# Altium schematic sheet micro.SchDoc: Micro controller
size A3; Author: Babaabasi; Engineer: Babaabasi; DocumentNumber: 1; Revision: 0.1
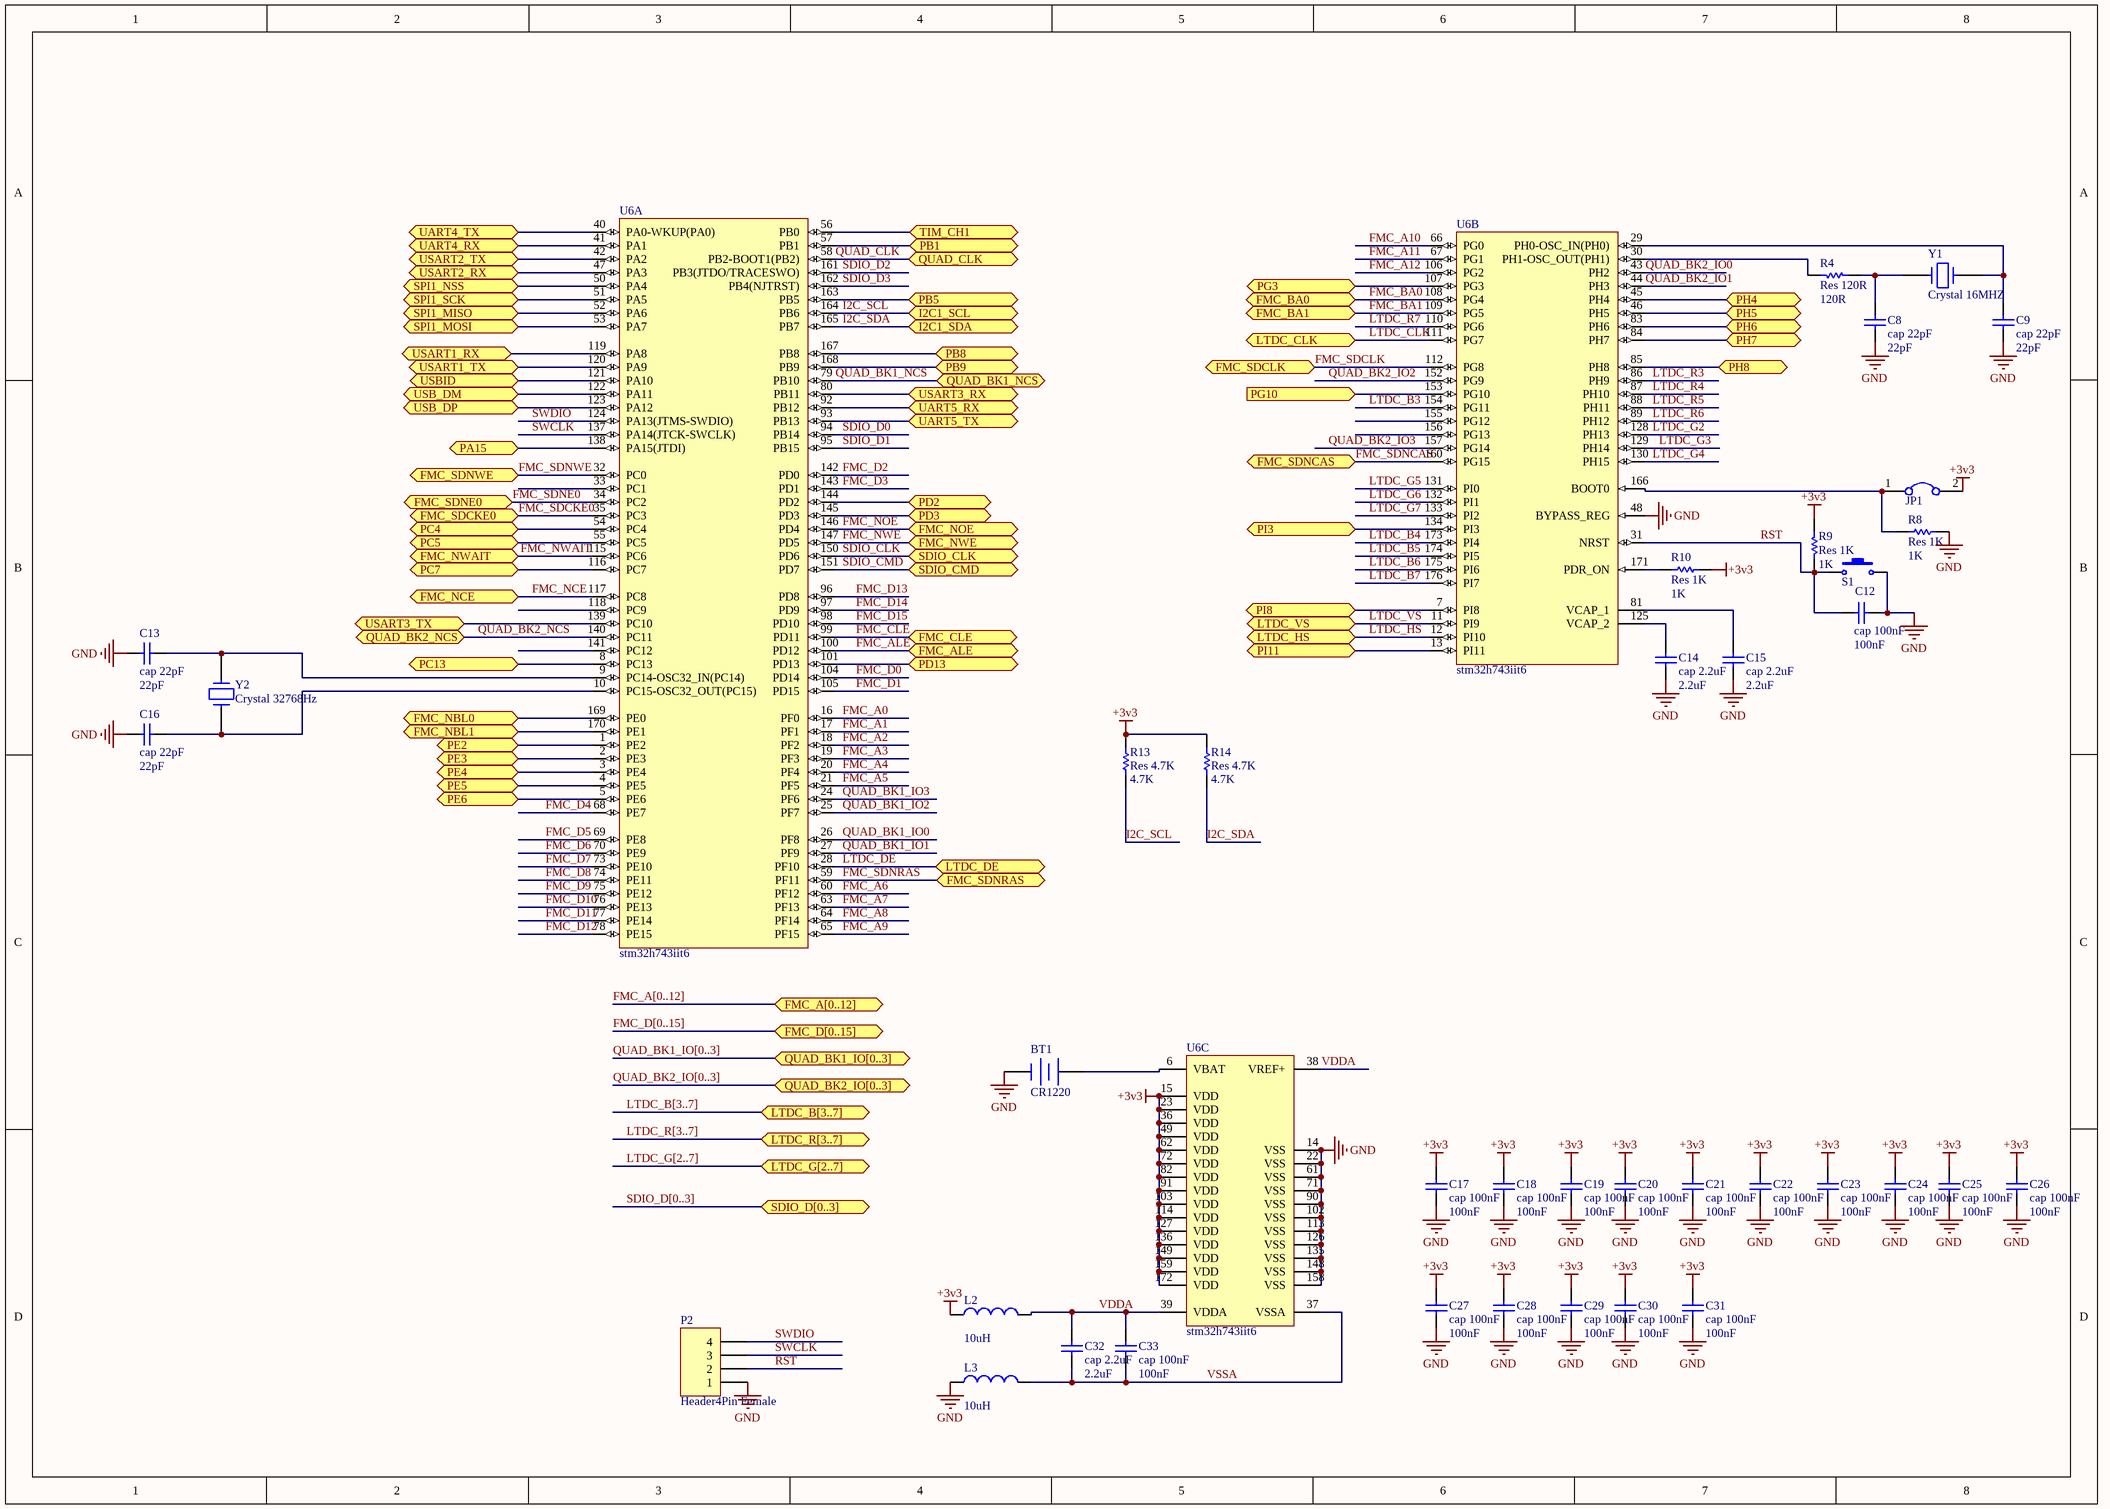
[diagram p0: micro.SchDoc]

## Parts
BT1  CR1220  [BTH1220]
C8  cap 22pF  value 22pF  [Cap 805]
C9  cap 22pF  value 22pF  [Cap 805]
C12  cap 100nF  value 100nF  [Cap 805]
C13  cap 22pF  value 22pF  [Cap 805]
C14  cap 2.2uF  value 2.2uF  [Cap 805]
C15  cap 2.2uF  value 2.2uF  [Cap 805]
C16  cap 22pF  value 22pF  [Cap 805]
C17  cap 100nF  value 100nF  [Cap 805]
C18  cap 100nF  value 100nF  [Cap 805]
C19  cap 100nF  value 100nF  [Cap 805]
C20  cap 100nF  value 100nF  [Cap 805]
C21  cap 100nF  value 100nF  [Cap 805]
C22  cap 100nF  value 100nF  [Cap 805]
C23  cap 100nF  value 100nF  [Cap 805]
C24  cap 100nF  value 100nF  [Cap 805]
C25  cap 100nF  value 100nF  [Cap 805]
C26  cap 100nF  value 100nF  [Cap 805]
C27  cap 100nF  value 100nF  [Cap 805]
C28  cap 100nF  value 100nF  [Cap 805]
C29  cap 100nF  value 100nF  [Cap 805]
C30  cap 100nF  value 100nF  [Cap 805]
C31  cap 100nF  value 100nF  [Cap 805]
C32  cap 2.2uF  value 2.2uF  [Cap 805]
C33  cap 100nF  value 100nF  [Cap 805]
JP1  Jumper  [Jumper Small - 2.54 - GRAY]  (value not drawn)  (no BOM)
L2  value 10uH  [IND1206]  (hidden comment: inductor 10uH)
L3  value 10uH  [IND1206]  (hidden comment: inductor 10uH)
P2  Header4Pin Female  [HDR1X4]
R4  Res 120R  value 120R  [RES 0805 (2012X06L)]
R8  Res 1K  value 1K  [RES 0805 (2012X06L)]
R9  Res 1K  value 1K  [RES 0805 (2012X06L)]
R10  Res 1K  value 1K  [RES 0805 (2012X06L)]
R13  Res 4.7K  value 4.7K  [RES 0805 (2012X06L)]
R14  Res 4.7K  value 4.7K  [RES 0805 (2012X06L)]
S1  Switch PB  [Switch - Push to On]  (value not drawn)
U6  stm32h743iit6  [STM-LQFP176_M]  (parts A,B,C of 3)
Y1  Crystal 16MHZ  [CRYSTAL Small]
Y2  Crystal 32768Hz  [XTAL RTC]

## Ports
FMC_A[0..12] (bidir), FMC_ALE (bidir), FMC_BA0 (bidir), FMC_BA1 (bidir), FMC_CLE (bidir), FMC_D[0..15] (bidir), FMC_NBL0 (bidir), FMC_NBL1 (bidir), FMC_NCE (bidir), FMC_NOE (bidir), FMC_NWAIT (bidir), FMC_NWE (bidir), FMC_SDCKE0 (bidir), FMC_SDCLK (bidir), FMC_SDNCAS (bidir), FMC_SDNE0 (bidir), FMC_SDNRAS (bidir), FMC_SDNWE (bidir), I2C1_SCL (bidir), I2C1_SDA (bidir), LTDC_B[3..7] (bidir), LTDC_CLK (bidir), LTDC_DE (bidir), LTDC_G[2..7] (bidir), LTDC_HS (bidir), LTDC_R[3..7] (bidir), LTDC_VS (bidir), PA15 (bidir), PB1 (bidir), PB5 (bidir), PB8 (bidir), PB9 (bidir), PC4 (bidir), PC5 (bidir), PC7 (bidir), PC13 (bidir), PD2 (bidir), PD3 (bidir), PD13 (bidir), PE2 (bidir), PE3 (bidir), PE4 (bidir), PE5 (bidir), PE6 (bidir), PG3 (bidir), PG10 (in), PH4 (bidir), PH5 (bidir), PH6 (bidir), PH7 (bidir), PH8 (bidir), PI3 (bidir), PI8 (bidir), PI11 (bidir), QUAD_BK1_IO[0..3] (bidir), QUAD_BK1_NCS (bidir), QUAD_BK2_IO[0..3] (bidir), QUAD_BK2_NCS (bidir), QUAD_CLK (bidir), SDIO_CLK (bidir), SDIO_CMD (bidir), SDIO_D[0..3] (bidir), SPI1_MISO (bidir), SPI1_MOSI (bidir), SPI1_NSS (bidir), SPI1_SCK (bidir), TIM_CH1 (bidir), UART4_RX (bidir), UART4_TX (bidir), UART5_RX (bidir), UART5_TX (bidir), USART1_RX (bidir), USART1_TX (bidir), USART2_RX (bidir), USART2_TX (bidir), USART3_RX (bidir), USART3_TX (bidir), USB_DM (bidir), USB_DP (bidir), USBID (bidir)

## Nets
+3v3: C17.2 C18.2 C19.2 C20.2 C21.2 C22.2 C23.2 C24.2 C25.2 C26.2 C27.2 C28.2 C29.2 C30.2 C31.2 JP1.2 L2.1 R9.1 R10.2 R13.1 R14.1 U6.15(VDD) U6.23(VDD) U6.36(VDD) U6.49(VDD) U6.62(VDD) U6.72(VDD) U6.82(VDD) U6.91(VDD) U6.103(VDD) U6.114(VDD) U6.127(VDD) U6.136(VDD) U6.149(VDD) U6.159(VDD) U6.172(VDD)
GND: BT1.2(-) C8.1 C9.2 C12.2 C13.1 C14.1 C15.1 C16.1 C17.1 C18.1 C19.1 C20.1 C21.1 C22.1 C23.1 C24.1 C25.1 C26.1 C27.1 C28.1 C29.1 C30.1 C31.1 L3.1 P2.1 R8.2 S1.1 U6.14(VSS) U6.22(VSS) U6.48(BYPASS_REG) U6.61(VSS) U6.71(VSS) U6.90(VSS) U6.102(VSS) U6.113(VSS) U6.126(VSS) U6.135(VSS) U6.148(VSS) U6.158(VSS)
FMC_A0: U6.16(PF0)
FMC_A1: U6.17(PF1)
FMC_A2: U6.18(PF2)
FMC_A3: U6.19(PF3)
FMC_A4: U6.20(PF4)
FMC_A5: U6.21(PF5)
FMC_A6: U6.60(PF12)
FMC_A7: U6.63(PF13)
FMC_A8: U6.64(PF14)
FMC_A9: U6.65(PF15)
FMC_A10: U6.66(PG0)
FMC_A11: U6.67(PG1)
FMC_A12: U6.106(PG2)
FMC_ALE: U6.100(PD12) ; port FMC_ALE
FMC_BA0: U6.108(PG4) ; port FMC_BA0
FMC_BA1: U6.109(PG5) ; port FMC_BA1
FMC_CLE: U6.99(PD11) ; port FMC_CLE
FMC_D0: U6.104(PD14)
FMC_D1: U6.105(PD15)
FMC_D2: U6.142(PD0)
FMC_D3: U6.143(PD1)
FMC_D4: U6.68(PE7)
FMC_D5: U6.69(PE8)
FMC_D6: U6.70(PE9)
FMC_D7: U6.73(PE10)
FMC_D8: U6.74(PE11)
FMC_D9: U6.75(PE12)
FMC_D10: U6.76(PE13)
FMC_D11: U6.77(PE14)
FMC_D12: U6.78(PE15)
FMC_D13: U6.96(PD8)
FMC_D14: U6.97(PD9)
FMC_D15: U6.98(PD10)
FMC_NBL0: U6.169(PE0) ; port FMC_NBL0
FMC_NBL1: U6.170(PE1) ; port FMC_NBL1
FMC_NCE: U6.117(PC8) ; port FMC_NCE
FMC_NOE: U6.146(PD4) ; port FMC_NOE
FMC_NWAIT: U6.115(PC6) ; port FMC_NWAIT
FMC_NWE: U6.147(PD5) ; port FMC_NWE
FMC_SDCKE0: U6.35(PC3) ; port FMC_SDCKE0
FMC_SDCLK: U6.112(PG8) ; port FMC_SDCLK
FMC_SDNCAS: U6.160(PG15) ; port FMC_SDNCAS
FMC_SDNE0: U6.34(PC2) ; port FMC_SDNE0
FMC_SDNRAS: U6.59(PF11) ; port FMC_SDNRAS
FMC_SDNWE: U6.32(PC0) ; port FMC_SDNWE
I2C_SCL: R13.2 U6.164(PB6) ; port I2C1_SCL
I2C_SDA: R14.2 U6.165(PB7) ; port I2C1_SDA
LTDC_B3: U6.154(PG11)
LTDC_B4: U6.173(PI4)
LTDC_B5: U6.174(PI5)
LTDC_B6: U6.175(PI6)
LTDC_B7: U6.176(PI7)
LTDC_CLK: U6.111(PG7) ; port LTDC_CLK
LTDC_DE: U6.28(PF10) ; port LTDC_DE
LTDC_G2: U6.128(PH13)
LTDC_G3: U6.129(PH14)
LTDC_G4: U6.130(PH15)
LTDC_G5: U6.131(PI0)
LTDC_G6: U6.132(PI1)
LTDC_G7: U6.133(PI2)
LTDC_HS: U6.12(PI10) ; port LTDC_HS
LTDC_R3: U6.86(PH9)
LTDC_R4: U6.87(PH10)
LTDC_R5: U6.88(PH11)
LTDC_R6: U6.89(PH12)
LTDC_R7: U6.110(PG6)
LTDC_VS: U6.11(PI9) ; port LTDC_VS
PA15: U6.138(PA15(JTDI)) ; port PA15
PB1: U6.57(PB1) ; port PB1
PB5: U6.163(PB5) ; port PB5
PB8: U6.167(PB8) ; port PB8
PB9: U6.168(PB9) ; port PB9
PC4: U6.54(PC4) ; port PC4
PC5: U6.55(PC5) ; port PC5
PC7: U6.116(PC7) ; port PC7
PC13: U6.8(PC13) ; port PC13
PD2: U6.144(PD2) ; port PD2
PD3: U6.145(PD3) ; port PD3
PD13: U6.101(PD13) ; port PD13
PE2: U6.1(PE2) ; port PE2
PE3: U6.2(PE3) ; port PE3
PE4: U6.3(PE4) ; port PE4
PE5: U6.4(PE5) ; port PE5
PE6: U6.5(PE6) ; port PE6
PG3: U6.107(PG3) ; port PG3
PG10: U6.153(PG10) ; port PG10
PH4: U6.45(PH4) ; port PH4
PH5: U6.46(PH5) ; port PH5
PH6: U6.83(PH6) ; port PH6
PH7: U6.84(PH7) ; port PH7
PH8: U6.85(PH8) ; port PH8
PI3: U6.134(PI3) ; port PI3
PI8: U6.7(PI8) ; port PI8
PI11: U6.13(PI11) ; port PI11
QUAD_BK1_IO0: U6.26(PF8)
QUAD_BK1_IO1: U6.27(PF9)
QUAD_BK1_IO2: U6.25(PF7)
QUAD_BK1_IO3: U6.24(PF6)
QUAD_BK1_NCS: U6.79(PB10) ; port QUAD_BK1_NCS
QUAD_BK2_IO0: U6.43(PH2)
QUAD_BK2_IO1: U6.44(PH3)
QUAD_BK2_IO2: U6.152(PG9)
QUAD_BK2_IO3: U6.157(PG14)
QUAD_BK2_NCS: U6.140(PC11) ; port QUAD_BK2_NCS
QUAD_CLK: U6.58(PB2-BOOT1(PB2)) ; port QUAD_CLK
RST: C12.1 P2.2 R9.2 S1.2 U6.31(NRST)
SDIO_CLK: U6.150(PD6) ; port SDIO_CLK
SDIO_CMD: U6.151(PD7) ; port SDIO_CMD
SDIO_D0: U6.94(PB14)
SDIO_D1: U6.95(PB15)
SDIO_D2: U6.161(PB3(JTDO/TRACESWO))
SDIO_D3: U6.162(PB4(NJTRST))
SPI1_MISO: U6.52(PA6) ; port SPI1_MISO
SPI1_MOSI: U6.53(PA7) ; port SPI1_MOSI
SPI1_NSS: U6.50(PA4) ; port SPI1_NSS
SPI1_SCK: U6.51(PA5) ; port SPI1_SCK
SWCLK: P2.3 U6.137(PA14(JTCK-SWCLK))
SWDIO: P2.4 U6.124(PA13(JTMS-SWDIO))
TIM_CH1: U6.56(PB0) ; port TIM_CH1
UART4_RX: U6.41(PA1) ; port UART4_RX
UART4_TX: U6.40(PA0-WKUP(PA0)) ; port UART4_TX
UART5_RX: U6.92(PB12) ; port UART5_RX
UART5_TX: U6.93(PB13) ; port UART5_TX
USART1_RX: U6.119(PA8) ; port USART1_RX
USART1_TX: U6.120(PA9) ; port USART1_TX
USART2_RX: U6.47(PA3) ; port USART2_RX
USART2_TX: U6.42(PA2) ; port USART2_TX
USART3_RX: U6.80(PB11) ; port USART3_RX
USART3_TX: U6.139(PC10) ; port USART3_TX
USB_DM: U6.122(PA11) ; port USB_DM
USB_DP: U6.123(PA12) ; port USB_DP
USBID: U6.121(PA10) ; port USBID
VDDA: C32.2 C33.2 L2.2 U6.38(VREF+) U6.39(VDDA)
VSSA: C32.1 C33.1 L3.2 U6.37(VSSA)
NetBT1_1: BT1.1(+) U6.6(VBAT)
NetC8_2: C8.2 R4.2 Y1.2
NetC9_1: C9.1 U6.29(PH0-OSC_IN(PH0)) Y1.1
NetC13_2: C13.2 U6.9(PC14-OSC32_IN(PC14)) Y2.1
NetC14_2: C14.2 U6.125(VCAP_2)
NetC15_2: C15.2 U6.81(VCAP_1)
NetC16_2: C16.2 U6.10(PC15-OSC32_OUT(PC15)) Y2.2
NetJP1_1: JP1.1 R8.1 U6.166(BOOT0)
NetR4_1: R4.1 U6.30(PH1-OSC_OUT(PH1))
NetR10_1: R10.1 U6.171(PDR_ON)

Not connected (* = marked no-connect by the designer): U6 33(PC1) 118(PC9) 141(PC12) 155(PG12) 156(PG13)

## Buses and harness runs
bus FMC_A[0..12] = port FMC_A[0..12]
bus FMC_D[0..15] = port FMC_D[0..15]
bus LTDC_B[3..7] = port LTDC_B[3..7]
bus LTDC_G[2..7] = port LTDC_G[2..7]
bus LTDC_R[3..7] = port LTDC_R[3..7]
bus QUAD_BK1_IO[0..3] = port QUAD_BK1_IO[0..3]
bus QUAD_BK2_IO[0..3] = port QUAD_BK2_IO[0..3]
bus SDIO_D[0..3] = port SDIO_D[0..3]

## Notes on the sheet
- Title
- Size:
- Date:
- A3
- Number:
- Time:
- Revision:
- Sheet
- of
- File:

## Library data of the parts
BT1 = Battery: CoinCell Battery; Published: 24-Mar-1999; LatestRevisionDate: 17-Jul-2002; LatestRevisionNote: Re-released for DXP Platform.; PackageReference: BAT-2; Publisher: Altium Limited; PackageDescription: Battery; 2 Leads
C8 C9 C12-C33 = Cap: Capacitor; Published: 8-Jun-2000; LatestRevisionDate: 17-Jul-2002; LatestRevisionNote: Re-released for DXP Platform.; PackageReference: RAD-0.3; Publisher: Altium Limited; PackageDescription: Radial Cap, Thru-Hole; 2 Leads; 0.3 in Pin Spacing
JP1 = Jumper: Boot select; Company: E.P.I.L; Defualt State: Close; Design Date: 2011/11/02
L2 L3 = Inductor: Code_IEC: 1005; Published: 8-Jun-2000; LatestRevisionDate: 29-May-2009; LatestRevisionNote: IPC-7351 Footprint Added.; PackageReference: 0402-A; Publisher: Altium Limited; PackageDescription: Chip Inductor; Code_JEITA: 0402
P2 = Header 4: Header, 4-Pin; LatestRevisionDate: 17-Jul-2002; LatestRevisionNote: Re-released for DXP Platform.; Publisher: Altium Limited
R4 R8-R10 R13 R14 = Res1: Resistor; Published: 8-Jun-2000; LatestRevisionDate: 17-Jul-2002; LatestRevisionNote: Re-released for DXP Platform.; PackageReference: AXIAL-0.3; Publisher: Altium Limited; PackageDescription: Axial Device, Thru-Hole; 2 Leads; 0.3 in Pin Spacing
S1 = Switch PB: Push Button Switch
U6 = STM32F429IGT6: ARM Cortex-M4 32-bit MCU+FPU, 225 DMIPS, 1024 kB Flash, 256 kB Internal RAM, 140 I/Os, 176-pin LQFP, -40 to 85 degC, Tray; Manufacturer: STMicroelectronics; D/A Converter: 2x12-bit; FLASH Size (Prog) (kB): 1024; I/Os (High Current): 140; Internal RAM Size (kB): 256; Operating Frequency(F) (Processor speed) (MHz): 180; Supply Voltage(Vcc) max (V): 3.6; Supply Voltage(Vcc) min (V): 1.8; DatasheetVersion: Rev. 2; PackageVersion: Rev. 4, 06/2013; PackageReference: LQFP176; PackageDescription: 176-Pin Low Profile Quad Flat Package, 24 x 24 mm Body, 0.5 mm Pitch; Supplier 1: Digi-Key; Supplier Part Number 1: STM32F429IGT6-ND; Supplier 2: Newark; Supplier Part Number 2: 06X3669; Supplier 3: Mouser; Supplier Part Number 3: 511-STM32F429IGT6; Core: ARM Cortex-M4; Packing: Tray; Mounting Technology: Surface Mount; PartNumber: STM32F429IGT6; ComponentLink1Description: Manufacturer URL; ComponentLink1URL: http://www.st.com/web/en/home.html; ComponentLink2Description: Datasheet; ComponentLink2URL: http://www.st.com/st-web-ui/static/active/en/resource/technical/document/data_brief/DM00053488.pdf; ComponentLink3Description: Package Specification; ComponentLink3URL: http://www.st.com/st-web-ui/static/active/en/resource/technical/document/datasheet/DM00035129.pdf
Y1 Y2 = CRYSTAL